# Altium schematic sheet Amplifier.SchDoc
size A; SheetNumber: 5; SheetTotal: 5
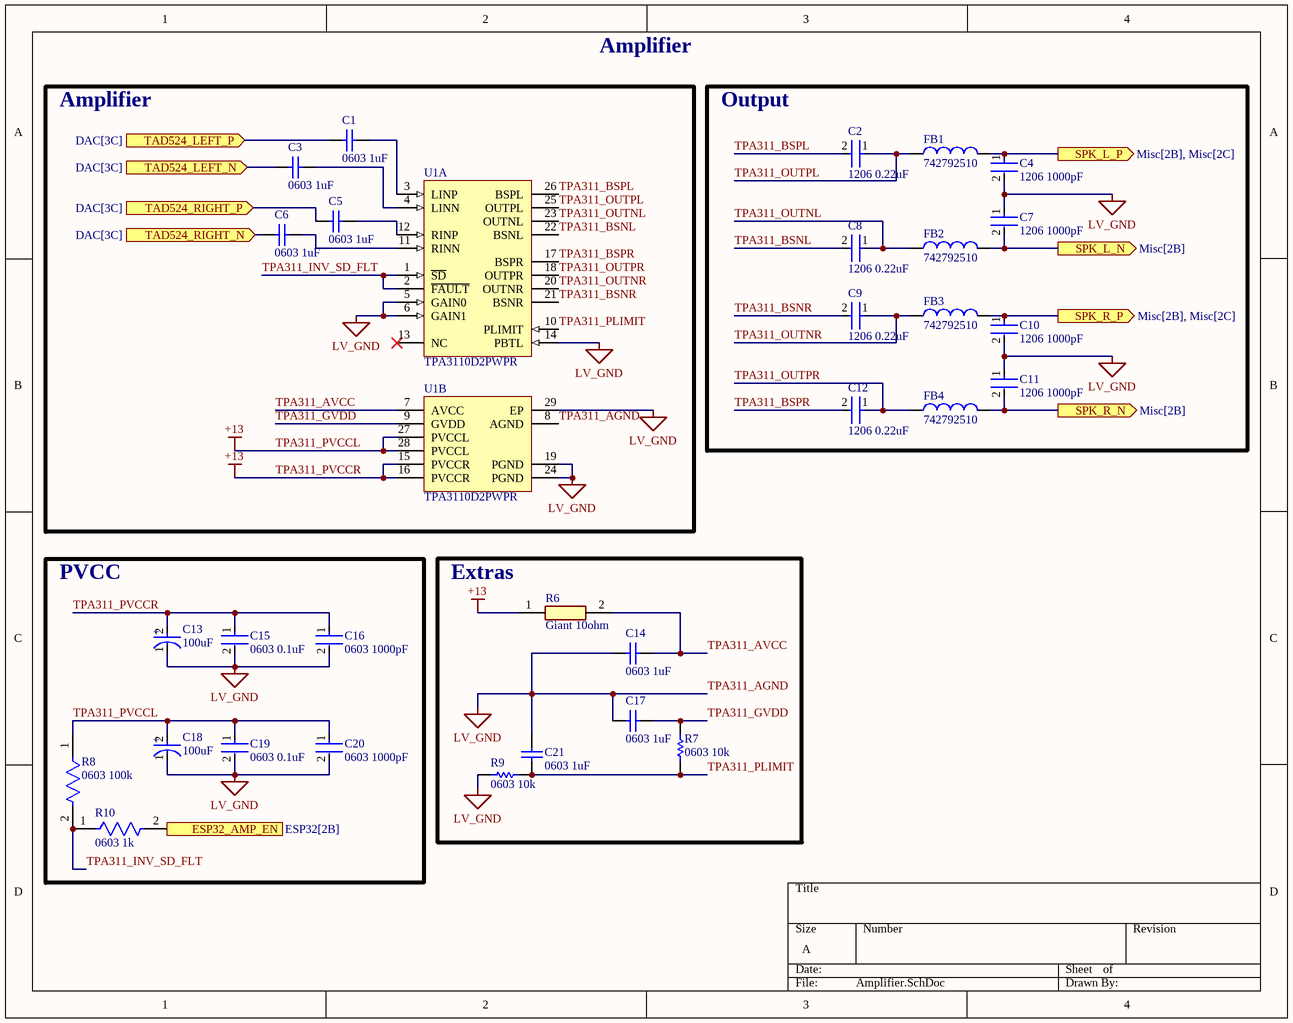
[diagram p0: Amplifier.SchDoc]

## Parts
C1  0603 1uF  [CAPC1608X87X35LL15T15]
C2  1206 0.22uF  [FP-C1206C-EB-MFG]
C3  0603 1uF  [CAPC1608X87X35LL15T15]
C4  1206 1000pF  [FP-C1206C-EB-MFG]
C5  0603 1uF  [CAPC1608X87X35LL15T15]
C6  0603 1uF  [CAPC1608X87X35LL15T15]
C7  1206 1000pF  [FP-C1206C-EB-MFG]
C8  1206 0.22uF  [FP-C1206C-EB-MFG]
C9  1206 0.22uF  [FP-C1206C-EB-MFG]
C10  1206 1000pF  [FP-C1206C-EB-MFG]
C11  1206 1000pF  [FP-C1206C-EB-MFG]
C12  1206 0.22uF  [FP-C1206C-EB-MFG]
C13  100uF  [FP-RAD-TH-D_8_0_5-L_11_5-MFG]
C14  0603 1uF  [CAPC1608X87X35LL15T15]
C15  0603 0.1uF  [FP-C0603C-CF-MFG]
C16  0603 1000pF  [FP-C0603C-CF-MFG]
C17  0603 1uF  [CAPC1608X87X35LL15T15]
C18  100uF  [FP-RAD-TH-D_8_0_5-L_11_5-MFG]
C19  0603 0.1uF  [FP-C0603C-CF-MFG]
C20  0603 1000pF  [FP-C0603C-CF-MFG]
C21  0603 1uF  [CAPC1608X87X35LL15T15]
FB1  742792510  [WE-CBF_1812_L4.5W3.2H1.5_HC]
FB2  742792510  [WE-CBF_1812_L4.5W3.2H1.5_HC]
FB3  742792510  [WE-CBF_1812_L4.5W3.2H1.5_HC]
FB4  742792510  [WE-CBF_1812_L4.5W3.2H1.5_HC]
R6  Giant 10ohm  [TO508P350X1040X2030-2P]
R7  0603 10k  [RESC1609X55X30LL15T15]
R8  0603 100k  [FP-RC0603-0_55-MFG]
R9  0603 10k  [RESC1609X55X30LL15T15]
R10  0603 1k  [FP-AC0603-IPC_B]
U1  TPA3110D2PWPR  [TI-PWP28-5720X1950TP_L]  (parts A,B of 2)

## Blocks framed on the sheet
Amplifier: C1 C3 C5 C6 U1
Output: C2 C4 C7-C12 FB1-FB4
PVCC: C13 C15 C16 C18-C20 R8 R10
Extras: C14 C17 C21 R6 R7 R9

## Ports
ESP32_AMP_EN (in, see ESP32[2B]), SPK_L_N (out, see Misc[2B]), SPK_L_P (out, see Misc[2B], Misc[2C]), SPK_R_N (out, see Misc[2B]), SPK_R_P (out, see Misc[2B], Misc[2C]), TAD524_LEFT_N (in, see DAC[3C]), TAD524_LEFT_P (in, see DAC[3C]), TAD524_RIGHT_N (in, see DAC[3C]), TAD524_RIGHT_P (in, see DAC[3C])

## Nets
TPA311_AGND: C4.2 C7.1 C10.2 C11.1 C13.1(C) C14.1 C15.2 C16.2 C17.1 C18.1(C) C19.2 C20.2 C21.1 R9.1 U1.5(GAIN0) U1.6(GAIN1) U1.8(AGND) U1.14(PBTL) U1.19(PGND) U1.24(PGND) U1.29(EP)  [also labelled LV_GND]
TPA311_PVCCL: C13.2(A) C15.1 C16.1 C18.2(A) C19.1 C20.1 R6.1 R8.1 U1.15(PVCCR) U1.16(PVCCR) U1.27(PVCCL) U1.28(PVCCL)  [also labelled +13, TPA311_PVCCR]
ESP32_AMP_EN: R10.2 ; port ESP32_AMP_EN
SPK_L_N: C7.2 FB2.2 ; port SPK_L_N
SPK_L_P: C4.1 FB1.2 ; port SPK_L_P
SPK_R_N: C11.2 FB4.2 ; port SPK_R_N
SPK_R_P: C10.1 FB3.2 ; port SPK_R_P
TAD524_LEFT_N: C3.1 ; port TAD524_LEFT_N
TAD524_LEFT_P: C1.1 ; port TAD524_LEFT_P
TAD524_RIGHT_N: C6.1 ; port TAD524_RIGHT_N
TAD524_RIGHT_P: C5.1 ; port TAD524_RIGHT_P
TPA311_AVCC: C14.2 R6.2 U1.7(AVCC)
TPA311_BSNL: C8.2 U1.22(BSNL)
TPA311_BSNR: C9.2 U1.21(BSNR)
TPA311_BSPL: C2.2 U1.26(BSPL)
TPA311_BSPR: C12.2 U1.17(BSPR)
TPA311_GVDD: C17.2 R7.1 U1.9(GVDD)
TPA311_INV_SD_FLT: R8.2 R10.1 U1.1(~{SD}) U1.2(~{FAULT})
TPA311_OUTNL: C8.1 FB2.1 U1.23(OUTNL)
TPA311_OUTNR: C9.1 FB3.1 U1.20(OUTNR)
TPA311_OUTPL: C2.1 FB1.1 U1.25(OUTPL)
TPA311_OUTPR: C12.1 FB4.1 U1.18(OUTPR)
TPA311_PLIMIT: C21.2 R7.2 R9.2 U1.10(PLIMIT)
NetC1_2: C1.2 U1.3(LINP)
NetC3_2: C3.2 U1.4(LINN)
NetC5_2: C5.2 U1.12(RINP)
NetC6_2: C6.2 U1.11(RINN)

Not connected (* = marked no-connect by the designer): U1 13(NC)*

## Notes on the sheet
- Amplifier
- (in symbol CMP-05427-002079-1) +

## Library data of the parts
C1 C3 C5 C6 C14 C17 C21 = CMP-2006-03713-1: Part Number: C0603C105K3RACTU; Manufacturer: Kemet
C2 C8 C9 C12 = CMP-03020-014280-1: CAP CER 0.22UF 50V X7R 1206; Manufacturer Part Number: C1206C224K5RACTU; Manufacturer: KEMET; Value: 0.22 μF; Automotive Grade: Grade 0; Tolerance: 0.1; Material: Ceramic; Temperature Coefficient: 15%; Octopart: https://octopart.com/c1206c224k5ractu-kemet-99129; Automotive: Yes; ComponentLink2URL: https://content.kemet.com/datasheets/KEM_C1007_X8R_ULTRA_150C_SMD.pdf; Ipc Land Pattern Name: CAPC320160X78; Digikey Description: CAP CER 0.22UF 50V X7R 1206; Voltage Rating: 50 V; RoHS: TRUE; Device Class L3: Ceramic Capacitors; Device Class L2: Capacitors; Device Class L1: Passive Components; Temperature Range Low: -55°C; Temperature: -55°C to +150°C; Temperature Range High: +150°C; ComponentLink2Description: Datasheet; Category: Cap; Height: 0.88mm; Capacitance: 0.22 μF; Temperature Characteristic: X7R; Package: C1206C-EB; Lead Free: Yes
C4 C7 C10 = CMP-03020-011698-1: CAP CER 100PF 100V C0G/NP0 1206; Manufacturer: KEMET; Manufacturer Part Number: C1206C101J1GACTU; Temperature Characteristic: C0G; Temperature Coefficient: 15%; Tolerance: 0.05; Automotive Grade: Grade 0; Material: Ceramic; Temperature Range Low: -55°C; Device Class L3: Ceramic Capacitors; Temperature: -55°C to +150°C; Value: 100 pF; Capacitance: 100 pF; ComponentLink2URL: https://content.kemet.com/datasheets/KEM_C1007_X8R_ULTRA_150C_SMD.pdf; Ipc Land Pattern Name: CAPC320160X78; Mouser Description: Multilayer Ceramic Capacitors MLCC - SMD/SMT 100volts 100pF C0G 5%; Automotive: Yes; Voltage Rating: 100 V; Octopart: https://octopart.com/c1206c101j1gactu-kemet-98729; Height: 0.88mm; RoHS: TRUE; Lead Free: Yes; Device Class L1: Passive Components; Package: C1206C-EB; Digikey Description: CAP CER 100PF 100V C0G/NP0 1206; ComponentLink2Description: Datasheet; Temperature Range High: +150°C; Category: Cap; Device Class L2: Capacitors
C11 = CMP-03020-011698-1: CAP CER 100PF 100V C0G/NP0 1206 / C1206C101J1GACTU; Manufacturer: KEMET; Temperature Characteristic: C0G; Temperature Coefficient: 15%; Tolerance: 0.05; Automotive Grade: Grade 0; Material: Ceramic; Temperature Range Low: -55°C; Device Class L3: Ceramic Capacitors; Temperature: -55°C to +150°C; Value: 1000 pF; Capacitance: 1000 pF; ComponentLink2URL: https://content.kemet.com/datasheets/KEM_C1007_X8R_ULTRA_150C_SMD.pdf; Ipc Land Pattern Name: CAPC320160X78; Mouser Description: Multilayer Ceramic Capacitors MLCC - SMD/SMT 100volts 100pF C0G 5%; Automotive: Yes; Voltage Rating: 100 V; Octopart: https://octopart.com/c1206c101j1gactu-kemet-98729; Height: 0.88mm; RoHS: TRUE; Lead Free: Yes; Device Class L1: Passive Components; Package: C1206C-EB; Digikey Description: CAP CER 100PF 100V C0G/NP0 1206; ComponentLink2Description: Datasheet; Temperature Range High: +150°C; Category: Cap; Manufacturer Part Number: C1206C101J1GACTU; Device Class L2: Capacitors
C13 C18 = CMP-05427-002079-1: Aluminum Electrolytic Capacitors (Radial Lead Type) 100uF ±20% 50V; ESR (Equivalent Series Resistance): 61mR; Lead Diameter: 0.6mm; Ripple Current (AC): 870mA; Life (Hours): 6000Hour; Lead/Base Style: Straight; Height - Seated (Max): 0.512inch; Height: 11.5mm; REACH SVHC: No SVHC; Contact Plating: Tin; Impedance: 61mR; Capacitance: 100uF; Voltage: 50V; Termination: Radial; Series: FR; Voltage Rating: 50V; Lead Pitch: 3.5mm; Diameter: 8mm; Number of Pins: 2; Min Operating Temperature: -40°C; Mount: Through Hole; Ripple Current: 870mA; Radiation Hardening: No; Length: 11.5mm; Max Operating Temperature: 105°C; Construction: RADIAL; Packaging: Bulk; Package Quantity: 200; Case/Package: Radial; RoHS Compliant: Yes; Voltage Rating (DC): 50V; Tolerance: 20%
C15 C19 = CMP-2006-03057-2: CAP CER 0.1UF 25V X7R 0603; Manufacturer Part Number: C0603C104K3RACTU; Manufacturer: KEMET; Value: 0.10 μF; Material: Ceramic; Tolerance: 0.1; Temperature Coefficient: 30ppm/°C; Automotive Grade: Grade 1; Lead Free: Yes; Device Class L3: Ceramic Capacitors; Voltage Rating: 25 V; Digikey Description: CAP CER 0.1UF 25V X7R 0603; Mouser Description: Multilayer Ceramic Capacitors MLCC - SMD/SMT 25volts 0.1uF X7R 10%; Package: C0603C-CF; Temperature Range Low: -55°C; Automotive: Yes; Device Class L2: Capacitors; Octopart: https://octopart.com/c0603c104k3ractu-kemet-127541; ComponentLink2Description: Datasheet; ComponentLink2URL: https://api.kemet.com/component-edge/download/datasheet/C0603C100J5GACAUTO.pdf; Temperature Range High: +125°C; RoHS: TRUE; Device Class L1: Passive Components; Category: Cap; Temperature: -55°C to +125°C; Capacitance: 0.10 μF; Height: 0.87mm; Temperature Characteristic: X7R
C16 C20 = CMP-2006-03010-2: CAP CER 1000PF 25V 5% NP0 0603; Manufacturer: KEMET; Manufacturer Part Number: C0603C102J3GACTU; Value: 1,000 pF; Tolerance: 0.05; Temperature Characteristic: C0G; Temperature Coefficient: 30ppm/°C; Automotive Grade: Grade 1; Material: Ceramic; Category: Cap; Device Class L2: Capacitors; Octopart: https://octopart.com/c0603c102j3gactu-kemet-8375722; Capacitance: 1,000 pF; ComponentLink2URL: https://api.kemet.com/component-edge/download/datasheet/C0603C100J5GACAUTO.pdf; Digikey Description: CAP CER 1000PF 25V 5% NP0 0603; Device Class L3: Ceramic Capacitors; Temperature Range Low: -55°C; Automotive: Yes; RoHS: TRUE; Temperature Range High: +125°C; ComponentLink2Description: Datasheet; Mouser Description: Multilayer Ceramic Capacitors MLCC - SMD/SMT 25volts 1000pF C0G 5%; Lead Free: Yes; Height: 0.87mm; Voltage Rating: 25 V; Temperature: -55°C to +125°C; Device Class L1: Passive Components; Package: C0603C-CF
FB1-FB4 = CMP-0220-00085-2: NexarPartId: 7861697; Impedance: 70Ω; Resistance: 30mΩ; Max DC Current: 3mA; Max Current Rating: 6A; Number of Lines: 1; Test Frequency: 100MHz; Tolerance: 25%; Case Code (Metric): 4532; RoHS: Compliant; Lead Free: Lead Free; Height: 1.5mm; REACH SVHC: Unknown; Case Code (Imperial): 1812; Length: 4.5mm; Min Operating Temperature: -55°C; Width: 3.2mm; Max Operating Temperature: 125°C; Depth: 3.2mm; Termination: SMD/SMT; Material: Ferrite; Packaging: Cut Tape (CT); DC Resistance (DCR): 30mΩ; Current Rating: 6A; Case/Package: SMD/SMT; Weight: 112.008966mg; Mount: Surface Mount
R6 = LTO050F10R00JTE3: Resistor; Manufacturer_Name: Vishay; Datasheet Link: https://componentsearchengine.com/Datasheets/2/LTO050F10R00JTE3.pdf; Height: 3.5mm; Manufacturer_Part_Number: LTO050F10R00JTE3; Mouser Part Number: 72-LTO050F10R00JTE3; Mouser Price/Stock: https://www.mouser.co.uk/ProductDetail/Vishay-Sfernice/LTO050F10R00JTE3?qs=YEvEAkYMKXtbfJC7MrgrfA%3D%3D; Arrow Part Number: LTO050F10R00JTE3; Arrow Price/Stock: https://www.arrow.com/en/products/lto050f10r00jte3/vishay?region=nac
R7 R9 = CMP-1012-00623-3: Chip Resistor, 10 KOhm, +/- 1%, 0.1 W, -55 to 155 degC, 0603 (1608 Metric), RoHS, Tape and Reel; Manufacturer: Panasonic; Voltage Rating: 75V; Case\/Package: 0603; Power Rating: 100mW; Resistance: 10KOhm; Temperature Coefficient: 100ppm\/degreesC; Number of Pins: 2; Package Reference: 603; Depth: 0.8mm; Mount: SurfaceMount; Package Description: 2-Pin Surface Mount Device, Body 1.6 x 0.85 mm; Datasheet Version: 02/2017; Length: 1.6mm; Lead Free: LeadFree; Height: 0.45mm; Number of Terminations: 2; Max Power Dissipation: 100mW; Min Operating Temperature: -55degC; Datasheet URL: https://industrial.panasonic.com/cdbs/www-data/pdf/RDA0000/AOA0000C304.pdf; Termination: SMD/SMT; Case Code (Metric): 1608; Case Code (Imperial): 0603; Tolerance: 1%; Max Operating Temperature: 155degC; RoHSCompliant: true; Voltage Rating (DC): 75V; Radiation Hardening: No; Packaging: TapeandReel; Composition: ThickFilm; Mounting Technology: SurfaceMount; Manufacturer URL: http://www.panasonic.com/; Width: 0.031inch; REACH SVHC: NoSVHC; Contact Plating: Tin; Military Standard: Not; Package Quantity: 1
R8 = CMP-2100-03662-2: RES SMD 100K OHM 1% 1/10W 0603; Voltage Rating (DC): 50V; Resistance: 100kR; Max Power Dissipation: 100mW; Temperature Coefficient: 100ppm/°C; Working Voltage: 75V; Length: 1.6mm; Lead Free: Lead Free; Number of Terminations: 2; Packaging: Tape and Reel; Voltage Rating: 50V; Termination: SMD/SMT; Width: 0.8mm; Resistor Type: Thick Film; Resistance Tolerance: 1%; Features: Moisture Resistant; Height: 0.45mm; Construction: Rectangular; Case/Package: 0603; Military Standard: Not; Case Code (Imperial): 0603; Series: RC; Technology: THICK FILM; Depth: 0.8mm; RoHS Compliant: Yes; REACH SVHC: No SVHC; Min Operating Temperature: -55°C; Case Code (Metric): 1608; Max Operating Temperature: 155°C; Power Rating: 100mW; Number of Pins: 2; Tolerance: 1%
R10 = CMP-2000-04828-3: RES 1kΩ 1.00% 0.1W 0603; Voltage Rating: 50V; Power Rating: 100mW; Tolerance: 1%; Temperature Coefficient: 100ppm/°C; Resistance: 1kR; Depth: 0.8mm; Case/Package: 0603; Size Code: 0603; Case Code (Metric): 1608; Height: 0.022inch; Series: AC; Width: 0.031inch; Construction: Rectangular; Length: 0.063inch; Case Code (Imperial): 0603; Package Quantity: 1; RoHS Compliant: Yes; Features: Moisture Resistant; Resistor Type: Thick Film; Max Power Dissipation: 100mW; Packaging: Tape and Reel; Termination: SMD/SMT; Ratings: AEC-Q200; Max Operating Temperature: 155°C; Min Operating Temperature: -55°C; Military Standard: Not; Lead Free: Lead Free; Number of Terminations: 2
U1 = CMP-0994-00255-1: 15 W Filter-Free Class D Stereo Amplifier with SpeakerGuard(TM), -40 to 85 degC, 28-pin SOP (PWP28), Green (RoHS & no Sb/Br); Manufacturer: Texas Instruments; Power Stage Supply Min(V): 8; Analog Supply Max [V]: 26; Input Type: Analog; Max. Number of Speaker Outputs: 2; SubFamily: Mid/High-Power Amplifier; PackageReference: PWP28-5720X1950TP; Analog Supply Min [V]: 8; ComponentLink1URL: http://www.ti.com/; ComponentLink1Description: Manufacturer URL; PartNumber: TPA3110D2PWPR; PackageDescription: 28-Pin Plastic Small Outline, Body 4.4 x 9.7 mm, Pitch 0.65 mm; PackageVersion: 4073225-6/I, 05/2011; Mounting Technology: Surface Mount; ComponentLink2URL: http://www.ti.com/general/docs/lit/getliterature.tsp?genericPartNumber=TPA3110D2&fileType=pdf; ComponentLink2Description: Datasheet; ComponentLink3URL: http://www.ti.com/litv/pdf/mpds373; Eco-Plan: Green (RoHS & no Sb/Br); Code_JEDEC: MO-153; ComponentLink3Description: Package Specification; DatasheetVersion: SLOS528D